# Altium schematic sheet CC-S03-V00-CANBUS.SchDoc: CANBUS (SN65HVD233)
size A3; DrawnBy: Jonn Dillon; DocumentNumber: 4; SheetNumber: 4; SheetTotal: 13; Project: Chassis Controller (Interim) 2020
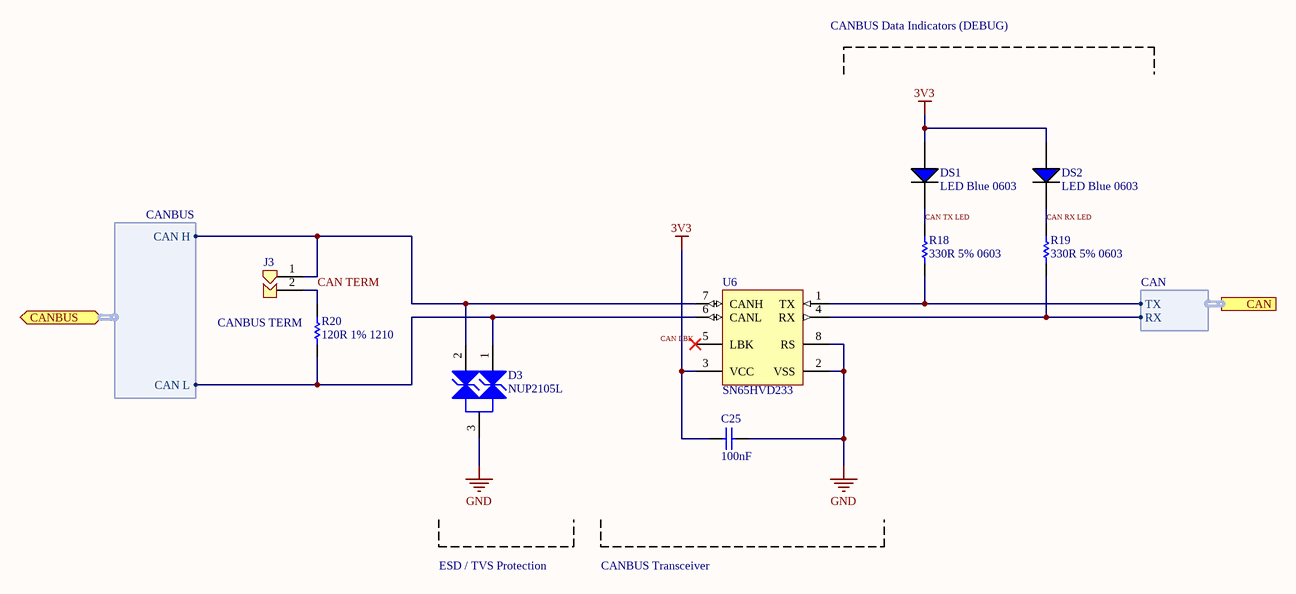
[diagram p0: CC-S03-V00-CANBUS.SchDoc]

## Parts
C25  100nF  [Cap_Ceramic_0603]
D3  NUP2105L  [NUP2105L]
DS1  LED Blue 0603  [LED BLUE 0603]
DS2  LED Blue 0603  [LED BLUE 0603]
J3  Jumper 2Way Solderable  [Jumper_2Way_Solderable]  (value not drawn)
R18  330R 5% 0603  [Res_ThinFilm_0603]
R19  330R 5% 0603  [Res_ThinFilm_0603]
R20  120R 1% 1210  [Res_ThinFilm_1210]
U6  SN65HVD233  [SN65HVD233DR]

## Ports
CAN (harness CAN), CANBUS (bidir, harness CANBUS)

## Harnesses
CANBUS: CAN H, CAN L
CAN: RX, TX

## Nets
3V3: C25.2 DS1.1(A) DS2.1(A) U6.3(VCC)
GND: C25.1 D3.3 U6.2(VSS) U6.8(RS)
CAN LBK: U6.5(LBK)
CAN RX LED: DS2.2(C) R19.2
CAN TERM: J3.2 R20.2
CAN TX LED: DS1.2(C) R18.2
NetD3_1: D3.1 R20.1 U6.6(CANL) ; port CANBUS.CAN L
NetD3_2: D3.2 J3.1 U6.7(CANH) ; port CANBUS.CAN H
NetR18_1: R18.1 U6.1(TX) ; port CAN.TX
NetR19_1: R19.1 U6.4(RX) ; port CAN.RX

## Notes on the sheet
- CANBUS Data Indicators (DEBUG)
- (near R20) CANBUS TERM
- ESD / TVS Protection
- CANBUS Transceiver
- Revision History:
- Sheet Title:
- Rev
- Date
- Description
- Project:
- Size:
- Drawn By:
- A3
- Number:
- Revision:
- Sheet
- Version:
- of
- QUT Motorsport
- O-120, Gardens Point
- 2 George Street
- Brisbane, QLD 4000
- Australia
- Print Date:
- Print Time:
- File Name:

## Library data of the parts
C25 = 100nF 50V 5% X7R 0603: Capacitor, Ceramic, SMD, 100nF, 50V, 5%, X7R, 0603
J3 = Jumper 2Way Side Solderable
R18 R19 = 330R 5% 0603: Resistor, SMD, 330R, 0.1W, 5%, 0603
R20 = 120R 1% 1210: Resistor, SMD, 120R, 0.25W, 1%, 1210
D3 = NUP2105L: ComponentLink1Description: Datasheet; ComponentLink1URL: https://www.onsemi.cn/PowerSolutions/document/NUP2105L-D.PDF; Parameter 1: *; ComponentLink2Description: LCSC; ComponentLink2URL: https://lcsc.com/product-detail/TVS_ON-Semiconductor-NUP2105LT1G_C14486.html; ComponentLink3Description: Digikey; ComponentLink3URL: https://www.digikey.com.au/product-detail/en/on-semiconductor/SZNUP2105LT1G/SZNUP2105LT1GOSCT-ND/3487669
U6 = SN65HVD233: ComponentLink1Description: LCSC; ComponentLink1URL: https://lcsc.com/product-detail/CAN-ICs_Texas-Instruments_SN65HVD233DRG4_Texas-Instruments-Texas-Instruments-SN65HVD233DRG4_C61643.html; ComponentLink2Description: Digikey; ComponentLink2URL: https://www.digikey.com.au/product-detail/en/texas-instruments/SN65HVD233DR/296-35967-1-ND/4134960; ComponentLink3Description: Datasheet; ComponentLink3URL: https://www.ti.com/lit/ds/symlink/sn65hvd233.pdf?ts=1588560888178; ComponentLink4Description: Ti Product Page; ComponentLink4URL: https://www.ti.com/product/SN65HVD233